# Altium schematic sheet BatteryPower.SchDoc
size A3; SheetNumber: 5; SheetTotal: 5; SPICEModelCacheHWZXMDFW: <root> / <DocumentId>HWZXMDFW</DocumentId> / </root>
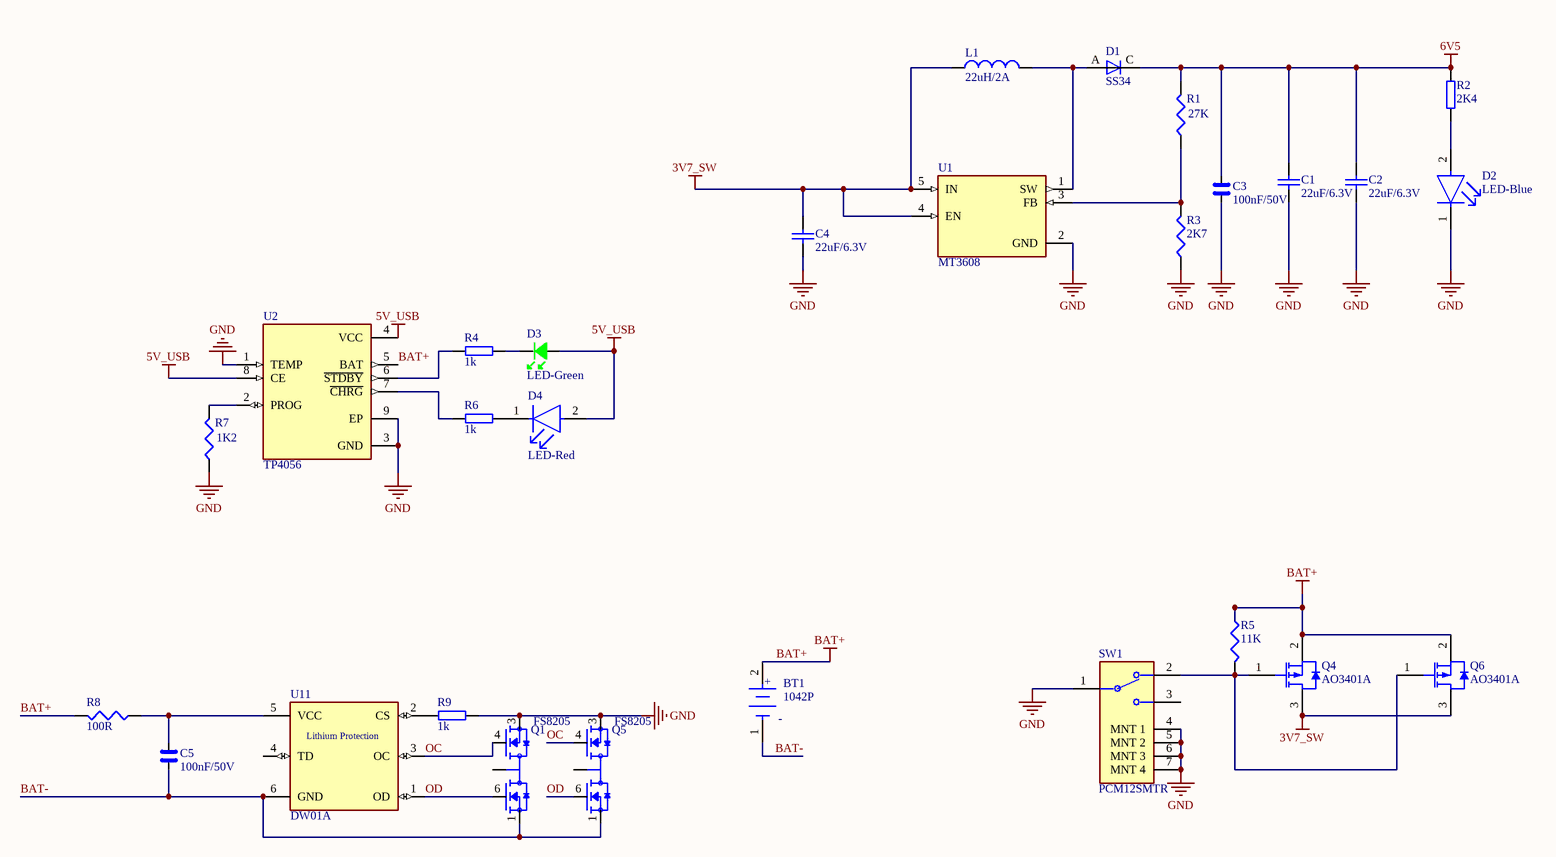
[diagram p0: BatteryPower.SchDoc]

## Parts
BT1  1042P  [FP-1042P-MFG]
C1  22uF/6.3V  [1608[0603]]
C2  22uF/6.3V  [1608[0603]]
C3  100nF/50V  [1608[0603]]
C4  22uF/6.3V  [1608[0603]]
C5  100nF/50V  [1608[0603]]
D1  SS34  [DIOM449X264X300L114X135N]
D2  LED-Blue  [FP-LTST-C193TBKT-5A-MFG]
D3  LED-Green  [LED0603G]
D4  LED-Red  [FP-LTST-C193KRKT-5A-MFG]
L1  22uH/2A  [INDM7166X18N]
Q1  FS8205  [SOT95P280X145-6N]
Q4  AO3401A  [AO-SOT-23-3L_V]
Q5  FS8205  [SOT95P280X145-6N]
Q6  AO3401A  [AO-SOT-23-3L_V]
R1  27K  [J1-0603]
R2  2K4  [1608[0603]]
R3  2K7  [J1-0603]
R4  1k  [1608[0603]]
R5  11K  [J1-0603]
R6  1k  [1608[0603]]
R7  1K2  [J1-0603]
R8  100R  [J1-0603]
R9  1k  [1608[0603]]
SW1  PCM12SMTR  [FP-PCM12SMTR-MFG]
U1  MT3608  [SOT95P280X145-6N]
U2  TP4056  [SOP127P600X175-9N]
U11  DW01A  [SOT23-6]

## Nets
3V7_SW: C4.2 L1.1 Q4.3(DRAIN) Q6.3(DRAIN) U1.4(EN) U1.5(IN)
5V_USB: D3.1 D4.2(A) U2.4(VCC) U2.8(CE)
6V5: C1.2 C2.2 C3.1 D1.C R1.2 R2.1
BAT+: BT1.2(A) Q4.2(SOURCE) Q6.2(SOURCE) R5.1 R8.2 U2.5(BAT)
GND: C1.1 C2.1 C3.2 C4.1 D2.1(C) Q1.3(S2) Q5.3(S2) R3.1 R7.1 R9.1 SW1.1 SW1.4(MNT_1) SW1.5(MNT_2) SW1.6(MNT_3) SW1.7(MNT_4) U1.2(GND) U2.1(TEMP) U2.3(GND) U2.9(EP)
BAT-: BT1.1(C) C5.2 Q1.1(S1) Q5.1(S1) U11.6(GND)
OC: Q1.4(G2) Q5.4(G2) U11.3(OC)
OD: Q1.6(G1) Q5.6(G1) U11.1(OD)
NetC5_1: C5.1 R8.1 U11.5(VCC)
NetD1_A: D1.A L1.2 U1.1(SW)
NetD2_2: D2.2(A) R2.2
NetD3_2: D3.2 R4.2
NetD4_1: D4.1(C) R6.2
NetQ1_2: Q1.2(D12) Q1.5(D12)
NetQ4_1: Q4.1(GATE) Q6.1(GATE) R5.2 SW1.2
NetQ5_2: Q5.2(D12) Q5.5(D12)
NetR1_1: R1.1 R3.2 U1.3(FB)
NetR4_1: R4.1 U2.6(~{STDBY})
NetR6_1: R6.1 U2.7(~{CHRG})
NetR7_2: R7.2 U2.2(PROG)
NetR9_2: R9.2 U11.2(CS)

Not connected (* = marked no-connect by the designer): SW1 3; U11 4(TD)

## Notes on the sheet
- (in symbol CMP-19636-000019-1) +; -
- (in symbol DW01A) Lithium Protection

## Library data of the parts
BT1 = CMP-19636-000019-1: BATTERY HOLDER 18650 SMD TAB; LCSCPartNo: C2988620
C1 C2 C4 = Cap: Capacitor; LCSCPartNo: C59461; Case/Package: 0603
C3 C5 = C: Cap Ceramic 0.1uF 50V X7R 20% SMD 0603 125C Paper T/R; Supplier 1: Digi-Key; Supplier Part Number 1: 1276-1941-1-ND; Case/Package: 0603; LCSCPartNo: C14663
D1 = EGF1B: 0.5mA@40V 40V Single 3A 0.55V@3A SMA(DO-214AC) Schottky; LCSCPartNo: C8678; Case/Package: SMA
D2 = CMP-2000-06624-2: LED BLUE CLEAR CHIP SMD; Case/Package: 0603; LCSCPartNo: C72041
D3 = LED-G: LED GREEN CLEAR CHIP SMD; Supplier 1: Digi-Key; Supplier Part Number 1: 160-1828-1-ND; Case/Package: 0603; LCSCPartNo: C72043
D4 = CMP-2000-06623-2: LED RED CLEAR CHIP SMD; Case/Package: 0603; LCSCPartNo: C2286
L1 = Inductor: LCSCPartNo: C705336
Q1 Q5 = FS8205: Dual N-Channel Enhancement Mode Power MOSFET; MF: Fortune Semiconductor; Package: Package; MP: FS8205; Value: *; Price: None; SnapEDA_Link: https://www.snapeda.com/parts/FS8205/Fortune%20Semiconductor/view-part/3216395/?ref=snap; Check_prices: https://www.snapeda.com/parts/FS8205/Fortune%20Semiconductor/view-part/3216395/?ref=eda; Availability: In Stock; LCSCPartNo: C2830320
Q4 Q6 = CMP-2000-05778-1: P-Channel MOSFET, 30 V, 4 A, -55 to 150 degC, 3-Pin SOT-23-3L, RoHS, Tape and Reel; LCSCPartNo: C15127
R1 R3 R5 R7 R8 = Res3: Resistor
  R1: LCSCPartNo: C22967
  R3: LCSCPartNo: C13167
  R5: LCSCPartNo: C25950; Case/Package: 0603
R2 R4 R6 R9 = R: Res General Purpose Thick Film 0603 1% 1/10W ±100ppm/°C Molded SMD Paper T/R; Supplier 1: Digi-Key; Case/Package: 0603
  R2: LCSCPartNo: C22940
  R4 R6 R9: LCSCPartNo: C21190
SW1 = CMP-2000-06884-2: SWITCH SLIDE SPDT 300MA 6V; LCSCPartNo: C109335
U1 = MT3608: High Efficiency 1.2MHz 2A Step Up Converter; LCSCPartNo: C84817
U2 = TP4056: Complete single cell Li-Ion battery with a constant current / constant voltage linear charger; LCSCPartNo: C16581
U11 = DW01A: SOT-23-6L Battery Management ICs ROHS; LCSCPartNo: C351410